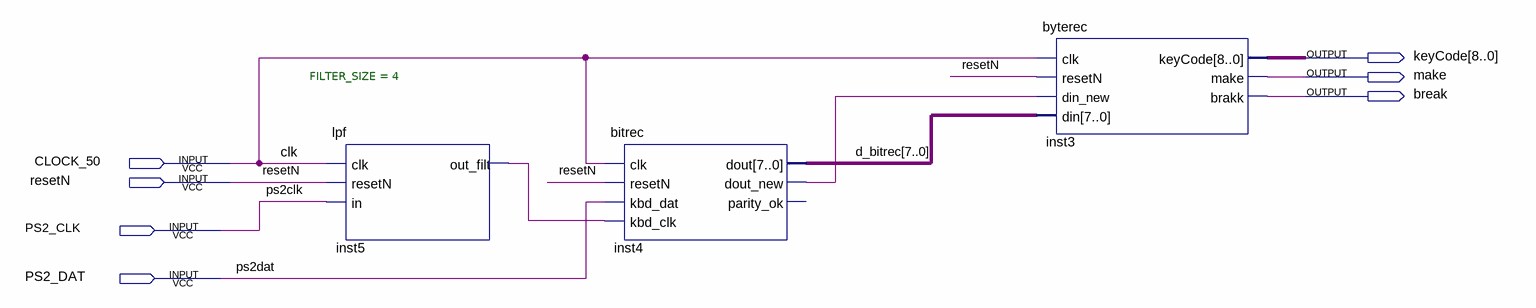
[diagram p0: schematic sheet]
// Quartus schematic KBDINTF.bdf as structural Verilog: 3 symbols, 7 pins
module KBDINTF (
  input  CLOCK_50,
  input  resetN,
  input  PS2_CLK,
  input  PS2_DAT,
  output [8:0] keyCode,
  output make,
  output \break 
);

  wire inst4_dout_new, inst5_out_filt;
  wire [7:0] d_bitrec;

  lpf #(.FILTER_SIZE(4)) inst5 (.clk(CLOCK_50), .resetN(resetN), .in(PS2_CLK), .out_filt(inst5_out_filt));
  bitrec inst4 (
    .clk(CLOCK_50), .resetN(resetN), .kbd_dat(PS2_DAT), .kbd_clk(inst5_out_filt), .dout(d_bitrec),
    .dout_new(inst4_dout_new));  // open: parity_ok
  byterec inst3 (
    .clk(CLOCK_50), .resetN(resetN), .din_new(inst4_dout_new), .din(d_bitrec), .keyCode(keyCode),
    .make(make), .brakk(\break ));

  // Other names for the same wires on the sheet: clk = CLOCK_50; ps2clk = PS2_CLK; ps2dat = PS2_DAT
endmodule
